# Altium schematic sheet Ports.SchDoc
size A
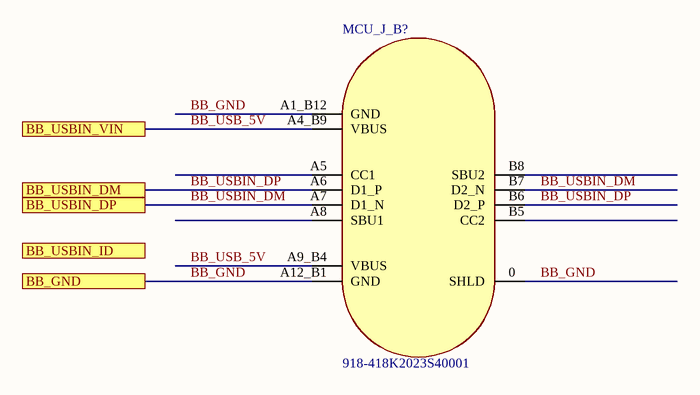
[diagram p0: Ports.SchDoc]

## Parts
MCU_J_B?  918-418K2023S40001  [DX07S016JA1R1500]

## Ports
BB_GND, BB_USBIN_DM, BB_USBIN_DP, BB_USBIN_ID, BB_USBIN_VIN

## Nets
BB_GND: MCU_J_B?.0(SHLD) MCU_J_B?.A1_B12(GND) MCU_J_B?.A12_B1(GND) ; port BB_GND
BB_USB_5V: MCU_J_B?.A4_B9(VBUS) MCU_J_B?.A9_B4(VBUS) ; port BB_USBIN_VIN
BB_USBIN_DM: MCU_J_B?.A7(D1_N) MCU_J_B?.B7(D2_N) ; port BB_USBIN_DP
BB_USBIN_DP: MCU_J_B?.A6(D1_P) MCU_J_B?.B6(D2_P) ; port BB_USBIN_DM

Not connected (* = marked no-connect by the designer): MCU_J_B? A5(CC1) A8(SBU1) B5(CC2) B8(SBU2)

## Library data of the parts
MCU_J_B? = 918-418K2023S40001: J - JACK - USB - Type C - Recepticle - SMT - 90°; JLC Availability: LCSC; LCSC Part #: C167321